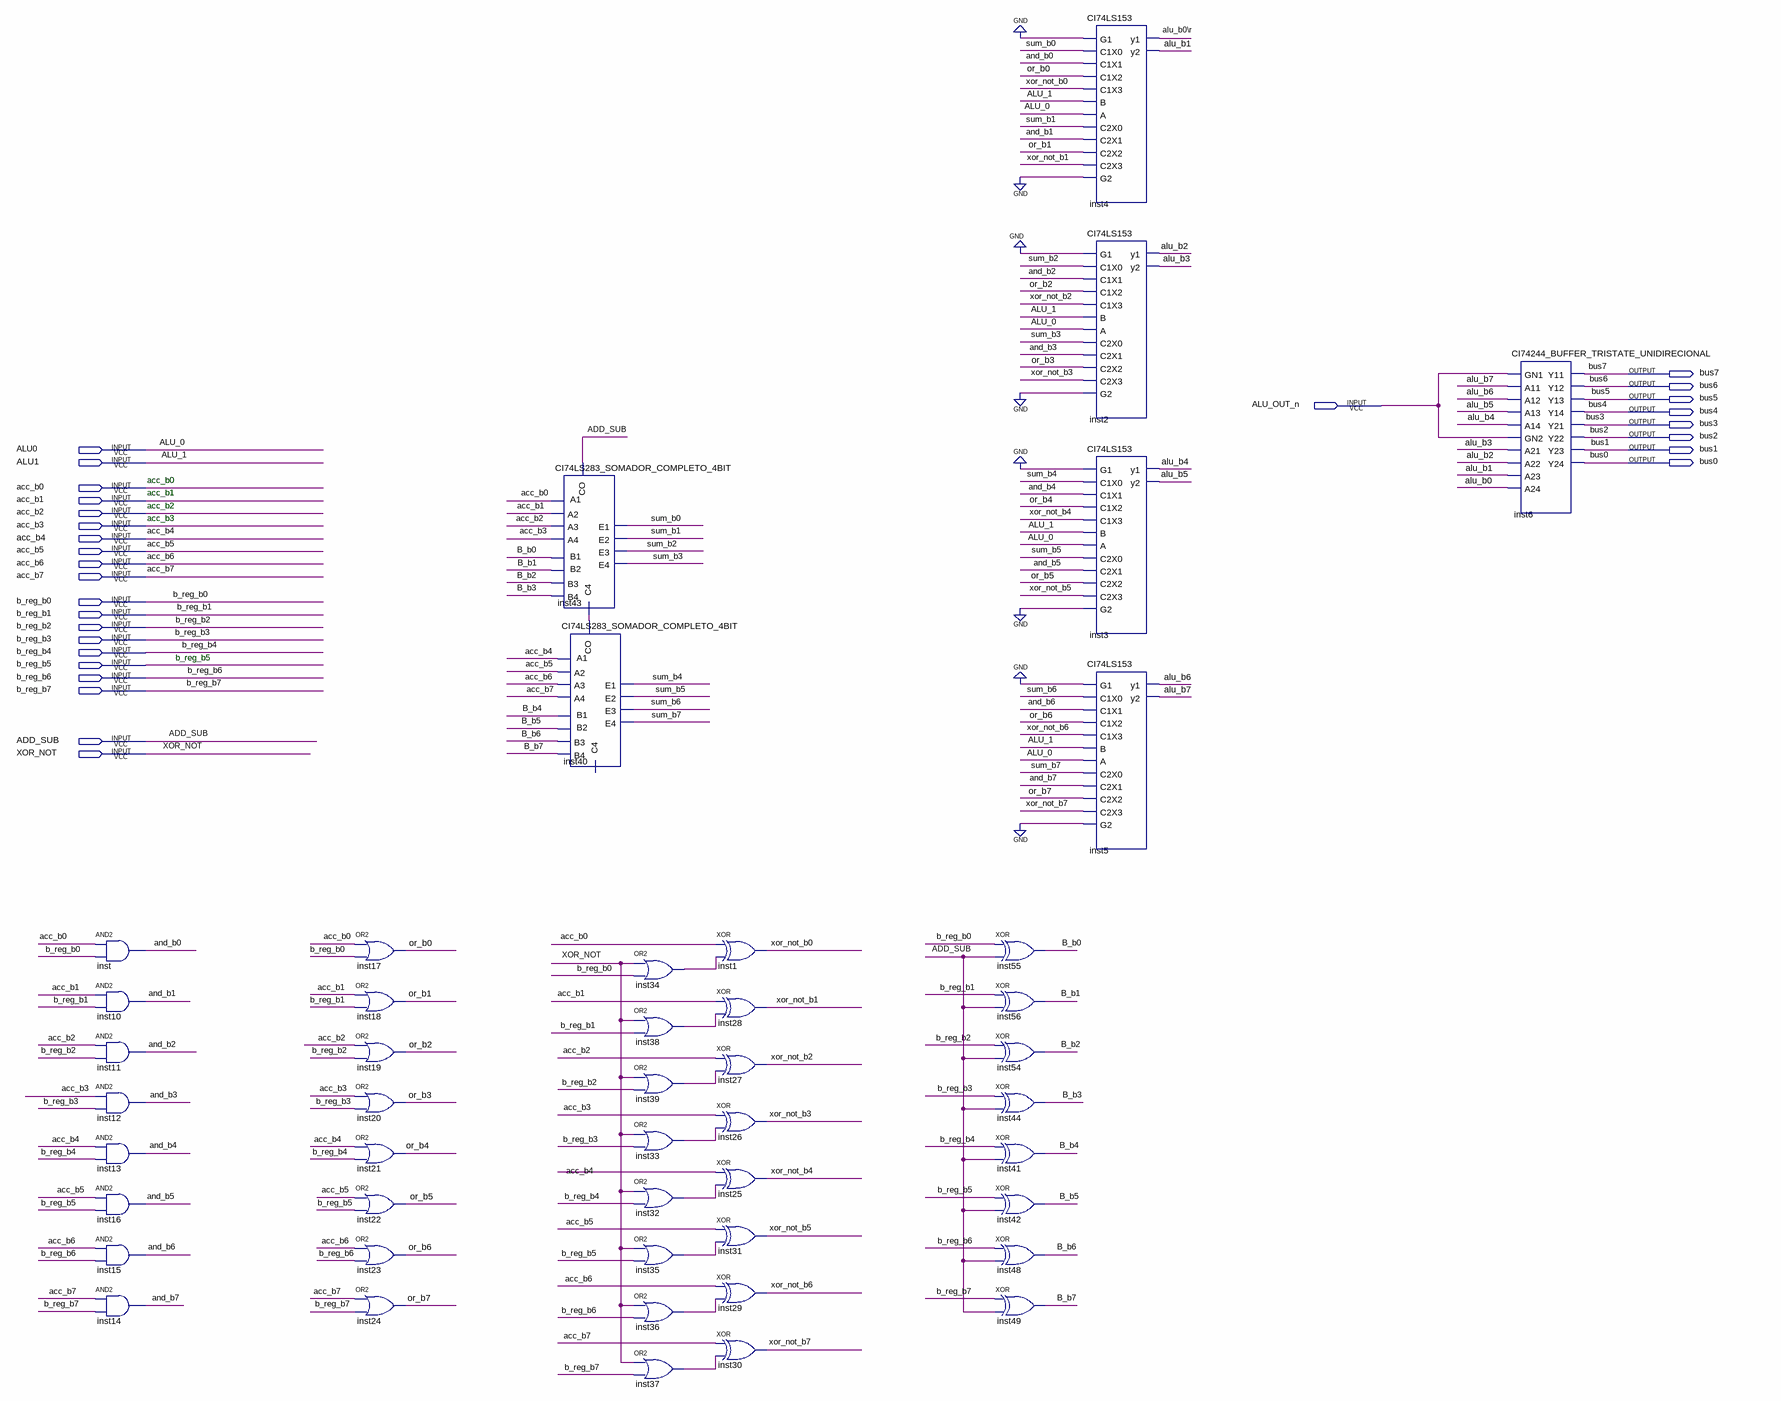
[diagram p0: schematic sheet]
// Quartus schematic ULA_NOVO.bdf as structural Verilog: 47 symbols, 29 pins
module ULA_NOVO (
  input  ALU_OUT_n,
  input  ALU0,
  input  ALU1,
  input  acc_b0,
  input  acc_b1,
  input  acc_b2,
  input  acc_b3,
  input  acc_b4,
  input  acc_b5,
  input  acc_b6,
  input  acc_b7,
  input  b_reg_b0,
  input  b_reg_b1,
  input  b_reg_b2,
  input  b_reg_b3,
  input  b_reg_b4,
  input  b_reg_b5,
  input  b_reg_b6,
  input  b_reg_b7,
  input  ADD_SUB,
  input  XOR_NOT,
  output bus7,
  output bus6,
  output bus5,
  output bus4,
  output bus3,
  output bus2,
  output bus1,
  output bus0
);

  wire alu_b0, \alu_b0\r , alu_b1, alu_b2, alu_b3, alu_b4, alu_b5, alu_b6, alu_b7, and_b0, and_b1, and_b2,
       and_b3, and_b4, and_b5, and_b6, and_b7, B_b0, B_b1, B_b2, B_b3, B_b4, B_b5, B_b6, B_b7, inst32_out,
       inst33_out, inst34_out, inst35_out, inst36_out, inst37_out, inst38_out, inst39_out, inst43_c4, or_b0,
       or_b1, or_b2, or_b3, or_b4, or_b5, or_b6, or_b7, sum_b0, sum_b1, sum_b2, sum_b3, sum_b4, sum_b5,
       sum_b6, sum_b7, xor_not_b0, xor_not_b1, xor_not_b2, xor_not_b3, xor_not_b4, xor_not_b5, xor_not_b6,
       xor_not_b7;

  and inst (and_b0, acc_b0, b_reg_b0);
  and inst10 (and_b1, acc_b1, b_reg_b1);
  and inst11 (and_b2, acc_b2, b_reg_b2);
  and inst12 (and_b3, acc_b3, b_reg_b3);
  and inst13 (and_b4, acc_b4, b_reg_b4);
  and inst16 (and_b5, acc_b5, b_reg_b5);
  and inst15 (and_b6, acc_b6, b_reg_b6);
  and inst14 (and_b7, acc_b7, b_reg_b7);
  or inst17 (or_b0, acc_b0, b_reg_b0);
  or inst18 (or_b1, acc_b1, b_reg_b1);
  or inst19 (or_b2, acc_b2, b_reg_b2);
  or inst20 (or_b3, acc_b3, b_reg_b3);
  or inst21 (or_b4, acc_b4, b_reg_b4);
  or inst22 (or_b5, acc_b5, b_reg_b5);
  or inst23 (or_b6, acc_b6, b_reg_b6);
  or inst24 (or_b7, acc_b7, b_reg_b7);
  CI74LS283_SOMADOR_COMPLETO_4BIT inst43 (
    .CO(ADD_SUB), .B1(B_b0), .A1(acc_b0), .B2(B_b1), .A2(acc_b1), .B3(B_b2), .A3(acc_b2), .B4(B_b3),
    .A4(acc_b3), .E1(sum_b0), .E2(sum_b1), .E3(sum_b2), .E4(sum_b3), .C4(inst43_c4));
  CI74LS283_SOMADOR_COMPLETO_4BIT inst40 (
    .CO(inst43_c4), .B1(B_b4), .A1(acc_b4), .B2(B_b5), .A2(acc_b5), .B3(B_b6), .A3(acc_b6), .B4(B_b7),
    .A4(acc_b7), .E1(sum_b4), .E2(sum_b5), .E3(sum_b6), .E4(sum_b7));  // open: C4
  or inst34 (inst34_out, XOR_NOT, b_reg_b0);
  or inst38 (inst38_out, XOR_NOT, b_reg_b1);
  or inst39 (inst39_out, XOR_NOT, b_reg_b2);
  or inst33 (inst33_out, XOR_NOT, b_reg_b3);
  or inst32 (inst32_out, XOR_NOT, b_reg_b4);
  or inst35 (inst35_out, XOR_NOT, b_reg_b5);
  or inst36 (inst36_out, XOR_NOT, b_reg_b6);
  or inst37 (inst37_out, XOR_NOT, b_reg_b7);
  xor inst1 (xor_not_b0, acc_b0, inst34_out);
  xor inst28 (xor_not_b1, acc_b1, inst38_out);
  xor inst27 (xor_not_b2, acc_b2, inst39_out);
  xor inst26 (xor_not_b3, acc_b3, inst33_out);
  xor inst25 (xor_not_b4, acc_b4, inst32_out);
  xor inst31 (xor_not_b5, acc_b5, inst35_out);
  xor inst29 (xor_not_b6, acc_b6, inst36_out);
  xor inst30 (xor_not_b7, acc_b7, inst37_out);
  xor inst55 (B_b0, b_reg_b0, ADD_SUB);
  xor inst56 (B_b1, b_reg_b1, ADD_SUB);
  xor inst54 (B_b2, b_reg_b2, ADD_SUB);
  xor inst44 (B_b3, b_reg_b3, ADD_SUB);
  xor inst41 (B_b4, b_reg_b4, ADD_SUB);
  xor inst42 (B_b5, b_reg_b5, ADD_SUB);
  xor inst48 (B_b6, b_reg_b6, ADD_SUB);
  xor inst49 (B_b7, b_reg_b7, ADD_SUB);
  CI74LS153 inst4 (
    .G1(1'b0), .C1X0(sum_b0), .C1X1(and_b0), .C1X2(or_b0), .C1X3(xor_not_b0), .B(ALU1), .A(ALU0),
    .C2X0(sum_b1), .C2X1(and_b1), .C2X2(or_b1), .C2X3(xor_not_b1), .G2(1'b0), .y1(\alu_b0\r ), .y2(alu_b1));
  CI74LS153 inst2 (
    .G1(1'b0), .C1X0(sum_b2), .C1X1(and_b2), .C1X2(or_b2), .C1X3(xor_not_b2), .B(ALU1), .A(ALU0),
    .C2X0(sum_b3), .C2X1(and_b3), .C2X2(or_b3), .C2X3(xor_not_b3), .G2(1'b0), .y1(alu_b2), .y2(alu_b3));
  CI74LS153 inst3 (
    .G1(1'b0), .C1X0(sum_b4), .C1X1(and_b4), .C1X2(or_b4), .C1X3(xor_not_b4), .B(ALU1), .A(ALU0),
    .C2X0(sum_b5), .C2X1(and_b5), .C2X2(or_b5), .C2X3(xor_not_b5), .G2(1'b0), .y1(alu_b4), .y2(alu_b5));
  CI74LS153 inst5 (
    .G1(1'b0), .C1X0(sum_b6), .C1X1(and_b6), .C1X2(or_b6), .C1X3(xor_not_b6), .B(ALU1), .A(ALU0),
    .C2X0(sum_b7), .C2X1(and_b7), .C2X2(or_b7), .C2X3(xor_not_b7), .G2(1'b0), .y1(alu_b6), .y2(alu_b7));
  CI74244_BUFFER_TRISTATE_UNIDIRECIONAL inst6 (
    .GN1(ALU_OUT_n), .A11(alu_b7), .A12(alu_b6), .A13(alu_b5), .A14(alu_b4), .GN2(ALU_OUT_n), .A21(alu_b3),
    .A22(alu_b2), .A23(alu_b1), .A24(alu_b0), .Y11(bus7), .Y12(bus6), .Y13(bus5), .Y14(bus4), .Y21(bus3),
    .Y22(bus2), .Y23(bus1), .Y24(bus0));

  // Other names for the same wires on the sheet: ALU_0 = ALU0; ALU_1 = ALU1

  // Notes on the sheet:
  //   acc_b0
  //   acc_b1
  //   acc_b2
  //   acc_b3
  //   b_reg_b5
endmodule
